# EAGLE schematic Board MASTER-SLAVE (EAGLE 9.5.1)
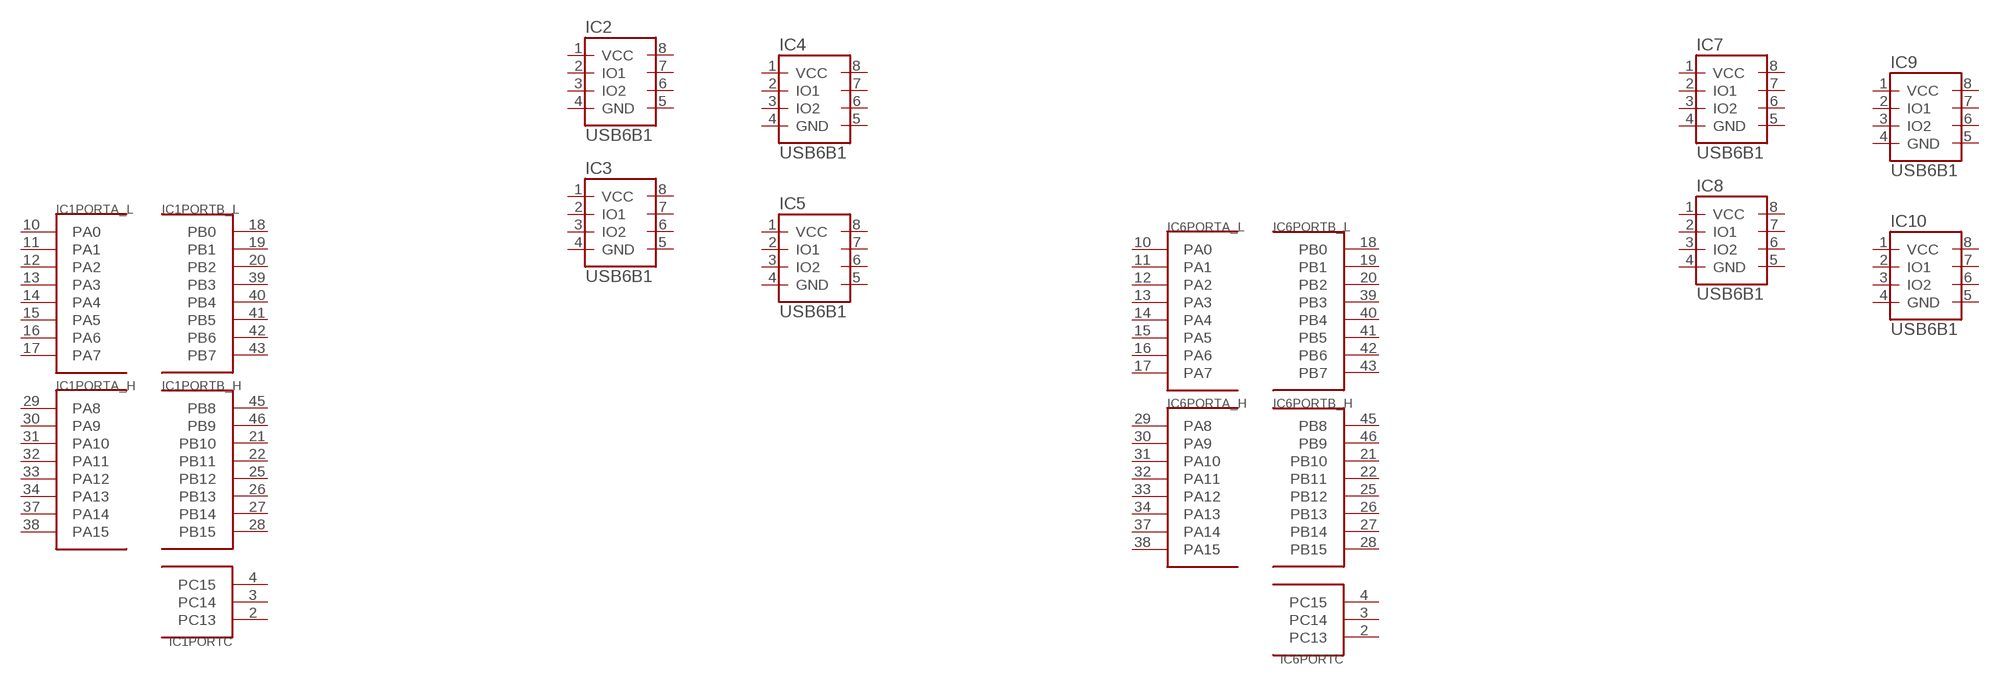
[diagram p0: schematic, sheet 1]

## Parts
IC1  STM32F10XCXT6  [TQFP48]
IC2  USB6B1  [SO08]
IC3  USB6B1  [SO08]
IC4  USB6B1  [SO08]
IC5  USB6B1  [SO08]
IC6  STM32F10XCXT6  [TQFP48]
IC7  USB6B1  [SO08]
IC8  USB6B1  [SO08]
IC9  USB6B1  [SO08]
IC10  USB6B1  [SO08]
Unconnected: IC1.2(PORTC:PC13) IC1.3(PORTC:PC14) IC1.4(PORTC:PC15) IC1.5(PORTD/OSC:PD0/OSC<=) IC1.6(PORTD/OSC:PD1/OSC=>) IC1.7(RESET:NRST) IC1.10(PORTA_L:PA0) IC1.11(PORTA_L:PA1) IC1.12(PORTA_L:PA2) IC1.13(PORTA_L:PA3) IC1.14(PORTA_L:PA4) IC1.15(PORTA_L:PA5) IC1.16(PORTA_L:PA6) IC1.17(PORTA_L:PA7) IC1.18(PORTB_L:PB0) IC1.19(PORTB_L:PB1) IC1.20(PORTB_L:PB2) IC1.21(PORTB_H:PB10) IC1.22(PORTB_H:PB11) IC1.25(PORTB_H:PB12) IC1.26(PORTB_H:PB13) IC1.27(PORTB_H:PB14) IC1.28(PORTB_H:PB15) IC1.29(PORTA_H:PA8) IC1.30(PORTA_H:PA9) IC1.31(PORTA_H:PA10) IC1.32(PORTA_H:PA11) IC1.33(PORTA_H:PA12) IC1.34(PORTA_H:PA13) IC1.37(PORTA_H:PA14) IC1.38(PORTA_H:PA15) IC1.39(PORTB_L:PB3) IC1.40(PORTB_L:PB4) IC1.41(PORTB_L:PB5) IC1.42(PORTB_L:PB6) IC1.43(PORTB_L:PB7) IC1.44(RESET:BOOT0) IC1.45(PORTB_H:PB8) IC1.46(PORTB_H:PB9) IC2.2(IO1) IC2.3(IO2) IC2.6(IO2) IC2.7(IO1) IC3.2(IO1) IC3.3(IO2) IC3.6(IO2) IC3.7(IO1) IC4.2(IO1) IC4.3(IO2) IC4.6(IO2) IC4.7(IO1) IC5.2(IO1) IC5.3(IO2) IC5.6(IO2) IC5.7(IO1) IC6.2(PORTC:PC13) IC6.3(PORTC:PC14) IC6.4(PORTC:PC15) IC6.5(PORTD/OSC:PD0/OSC<=) IC6.6(PORTD/OSC:PD1/OSC=>) IC6.7(RESET:NRST) IC6.10(PORTA_L:PA0) IC6.11(PORTA_L:PA1) IC6.12(PORTA_L:PA2) IC6.13(PORTA_L:PA3) IC6.14(PORTA_L:PA4) IC6.15(PORTA_L:PA5) IC6.16(PORTA_L:PA6) IC6.17(PORTA_L:PA7) IC6.18(PORTB_L:PB0) IC6.19(PORTB_L:PB1) IC6.20(PORTB_L:PB2) IC6.21(PORTB_H:PB10) IC6.22(PORTB_H:PB11) IC6.25(PORTB_H:PB12) IC6.26(PORTB_H:PB13) IC6.27(PORTB_H:PB14) IC6.28(PORTB_H:PB15) IC6.29(PORTA_H:PA8) IC6.30(PORTA_H:PA9) IC6.31(PORTA_H:PA10) IC6.32(PORTA_H:PA11) IC6.33(PORTA_H:PA12) IC6.34(PORTA_H:PA13) IC6.37(PORTA_H:PA14) IC6.38(PORTA_H:PA15) IC6.39(PORTB_L:PB3) IC6.40(PORTB_L:PB4) IC6.41(PORTB_L:PB5) IC6.42(PORTB_L:PB6) IC6.43(PORTB_L:PB7) IC6.44(RESET:BOOT0) IC6.45(PORTB_H:PB8) IC6.46(PORTB_H:PB9) IC7.2(IO1) IC7.3(IO2) IC7.6(IO2) IC7.7(IO1) IC8.2(IO1) IC8.3(IO2) IC8.6(IO2) IC8.7(IO1) IC9.2(IO1) IC9.3(IO2) IC9.6(IO2) IC9.7(IO1) IC10.2(IO1) IC10.3(IO2) IC10.6(IO2) IC10.7(IO1)

## Power pins joined to a net without a drawn wire
GND: IC2.4(GND) IC2.5(GND) IC3.4(GND) IC3.5(GND) IC4.4(GND) IC4.5(GND) IC5.4(GND) IC5.5(GND) IC7.4(GND) IC7.5(GND) IC8.4(GND) IC8.5(GND) IC9.4(GND) IC9.5(GND) IC10.4(GND) IC10.5(GND)
VBAT: IC1.1(AN_POWER:VBAT) IC6.1(AN_POWER:VBAT)
VCC: IC2.1(VCC) IC2.8(VCC) IC3.1(VCC) IC3.8(VCC) IC4.1(VCC) IC4.8(VCC) IC5.1(VCC) IC5.8(VCC) IC7.1(VCC) IC7.8(VCC) IC8.1(VCC) IC8.8(VCC) IC9.1(VCC) IC9.8(VCC) IC10.1(VCC) IC10.8(VCC)
VDD_1: IC1.24(POWER:VDD_1) IC6.24(POWER:VDD_1)
VDD_2: IC1.36(POWER:VDD_2) IC6.36(POWER:VDD_2)
VDD_3: IC1.48(POWER:VDD_3) IC6.48(POWER:VDD_3)
VDDA: IC1.9(AN_POWER:VDDA) IC6.9(AN_POWER:VDDA)
VSS_1: IC1.23(POWER:VSS_1) IC6.23(POWER:VSS_1)
VSS_2: IC1.35(POWER:VSS_2) IC6.35(POWER:VSS_2)
VSS_3: IC1.47(POWER:VSS_3) IC6.47(POWER:VSS_3)
VSSA: IC1.8(AN_POWER:VSSA) IC6.8(AN_POWER:VSSA)

## Library data of the parts
IC1 IC6 = stm32:STM32F10XCXT6: ST STM32F101/103 48pin LQFP
IC2-IC5 IC7-IC10 = st-microelectronics:USB6B1: DATA LINES PROTECTION Source: http://www.st.com/stonline/products/literature/ds/5605.pdf; MPN: USB6B1; OC_FARNELL: 9804358; OC_NEWARK: 26M4750